# EAGLE design nl (EAGLE 6.3)
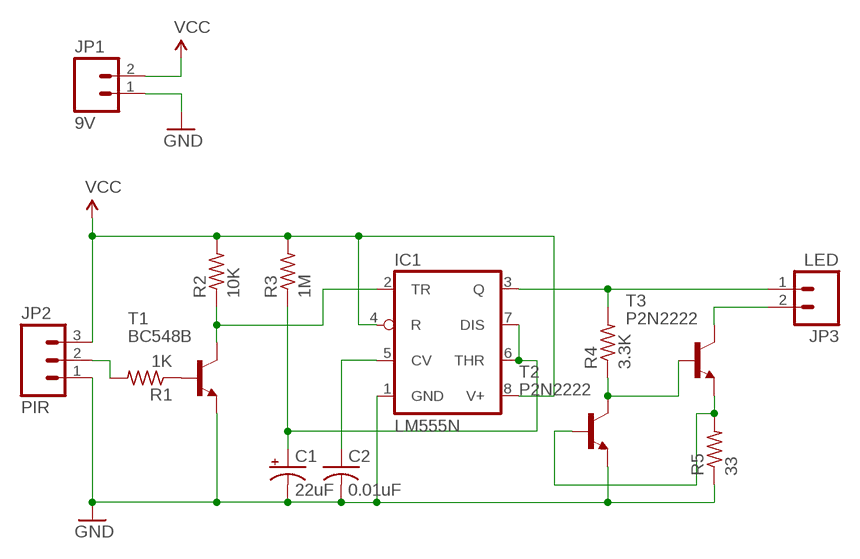
[diagram p0: schematic, sheet 1]

## Parts
C1  22uF  CPOL-USE5-6  [E5-6]
C2  0.01uF  C-US025-024X044  [C025-024X044]
IC1  LM555N  [DIL08-ROUND]
JP1  9V  M02PTH  [1X02]
JP2  PIR  M03PTH  [1X03]
JP3  LED  M02PTH  [1X02]
R1  1K  R-US_0309/12  [0309/12]
R2  10K  R-US_0309/12  [0309/12]
R3  1M  R-US_0309/12  [0309/12]
R4  3.3K  R-US_0309/12  [0309/12]
R5  33  R-US_0309/12  [0309/12]
T1  BC548B  [TO92-EBC]
T2  P2N2222  BC548  [TO92-EBC]
T3  P2N2222  BC548  [TO92-EBC]

## Nets
GND: C1.- C2.2 IC1.1(GND) JP1.1 JP2.1 R5.1 T1.E T2.E
N$1: R1.1 T1.B
N$2: JP2.2 R1.2
N$3: R5.2 T2.B T3.E
N$4: C2.1 IC1.5(CV)
N$5: JP3.2 T3.C
N$6: IC1.3(Q) JP3.1 R4.2
N$7: IC1.2(TR) R2.1 T1.C
N$8: C1.+ IC1.6(THR) IC1.7(DIS) R3.1
N$9: R4.1 T2.C T3.B
VCC: IC1.4(R) IC1.8(V+) JP1.2 JP2.3 R2.2 R3.2

## Library data of the parts
C1 = adafruit:CPOL-US: POLARIZED CAPACITOR, American symbol
C2 = adafruit:C-US: CAPACITOR, American symbol
IC1 = adafruit:*555: TIMER Changed DIP package to have round (not oval) pin pads http://www.ladyada.net/library/pcb/eaglelibrary.html
JP1 JP3 = SparkFun-Connectors:M02: Header 2 Standard 2-pin 0.1" header. Use with straight break away headers (SKU : PRT-00116), right angle break away headers (PRT-00553), swiss pins (PRT-00743), machine pins (PRT-00117), and female headers (PRT-00115). Molex polarized connector foot print use with SKU : PRT-08233 with associated crimp pins and housings.
JP2 = SparkFun-Connectors:M03: Header 3 Standard 3-pin 0.1" header. Use with straight break away headers (SKU : PRT-00116), right angle break away headers (PRT-00553), swiss pins (PRT-00743), machine pins (PRT-00117), and female headers (PRT-00115). Molex polarized connector foot print use with SKU : PRT-08232 with associated crimp pins and housings.
R1-R5 = adafruit:R-US_: RESISTOR, American symbol
T1-T3 = transistor-npn:BC548*: NPN Transistor

## Board
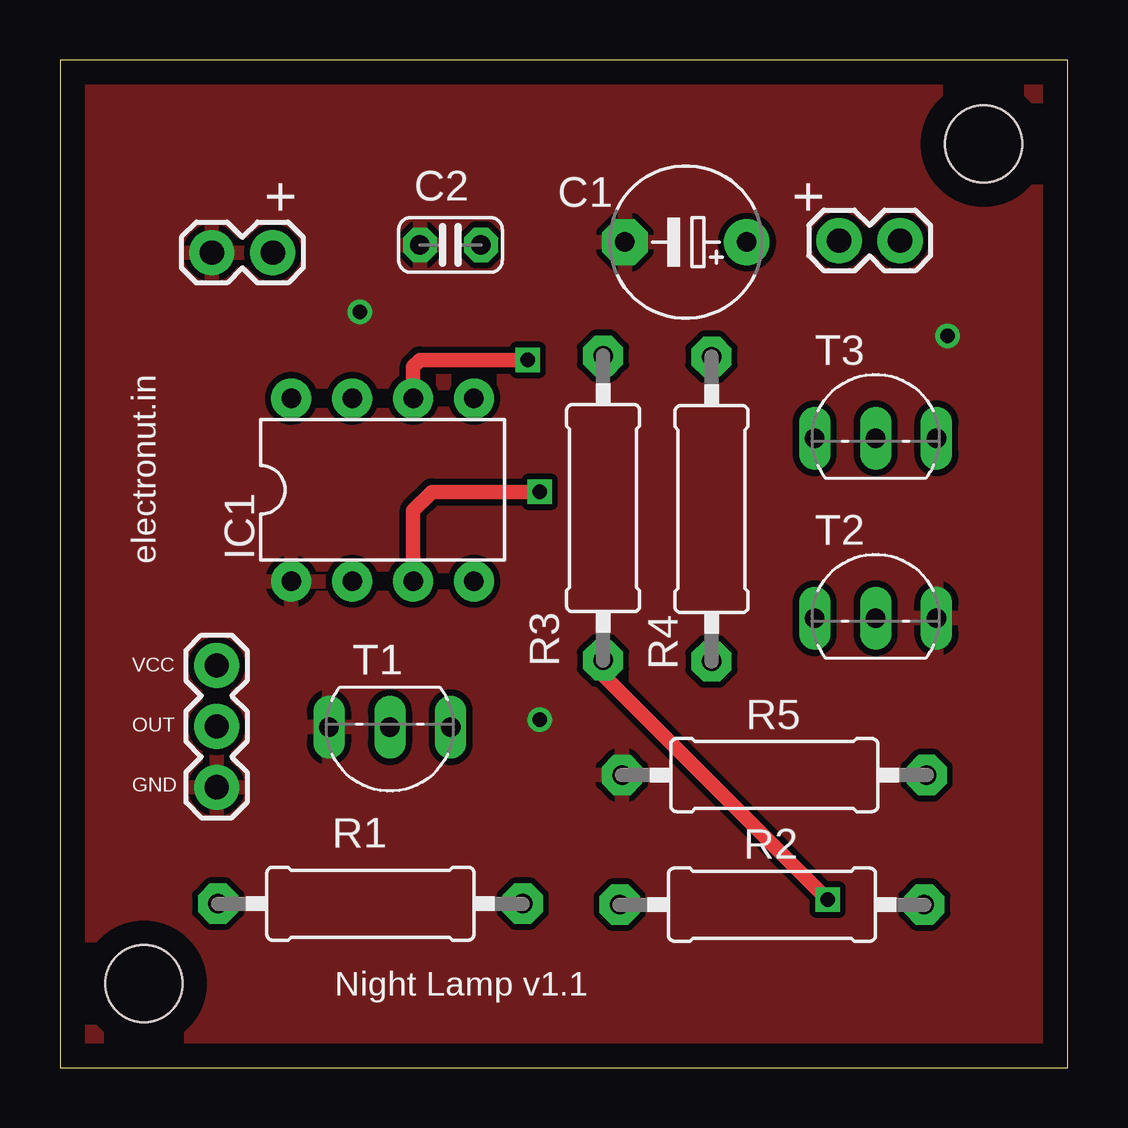
[diagram p1: board, top side]
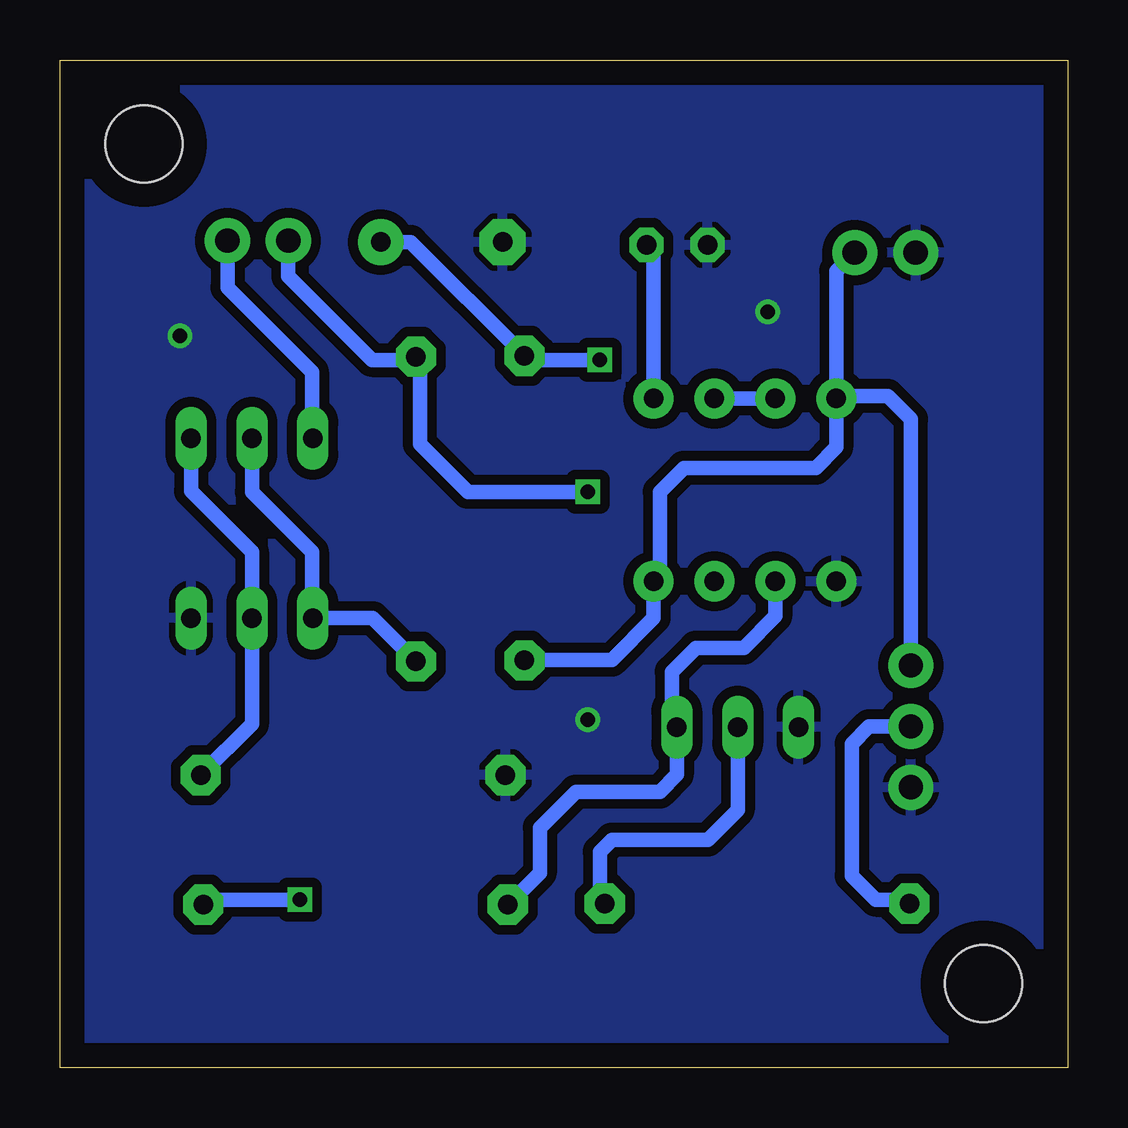
[diagram p2: board, bottom side, seen from below]

Size 42 x 42 mm. Coordinates in mm from the lower left corner, seen from the top.
Outline: 0,0 42,0 42,42 0,42 0,0
Copper layers (1*16): Top 0.035mm / dielectric 1.5mm / Bottom 0.035mm
Design rules "default": minimum track width 10mil, minimum drill 24mil, track to track 8mil, track to pad 8mil, pad to pad 8mil, via to via 8mil, smd to smd 8mil, copper to edge 40mil, drill to drill 8mil, minimum pad ring 10mil, minimum via ring 8mil, stop-mask expansion 4mil, vias tented up to drill 0mil, thermal gap 10mil
Holes 3.2 mm at 3.5,3.5 38.5,38.5

### Footprints (pad centres in the part's own frame; a part is rotated, then mirrored left to right if it is on the bottom)
E5-6 = drill 0.813 pad 1.905: + -2.54,0 | drill 0.813 pad 1.905 octagon: - 2.54,0
C025-024X044 = drill 0.813 pad 1.422 octagon: 1 -1.27,0; 2 1.27,0
DIL08-ROUND = drill 0.813 pad 1.676: 1 -3.81,-3.81; 2 -1.27,-3.81; 3 1.27,-3.81; 4 3.81,-3.81; 5 3.81,3.81; 6 1.27,3.81; 7 -1.27,3.81; 8 -3.81,3.81
1X02 = drill 1.016 pad 1.88: 1 0,0; 2 2.54,0
1X03 = drill 1.016 pad 1.88: 1 0,0; 2 2.54,0; 3 5.08,0
0309/12 = drill 0.813 pad 1.676 octagon: 1 -6.35,0; 2 6.35,0
TO92-EBC = drill 0.813 long: B 0,-1.27; C -2.54,-1.27; E 2.54,-1.27

### Placement (x,y rotation side)
C1  26.09,34.41 180 top
C2  16.28,34.29 180 top
IC1  13.45,24.08 0 top
JP1  6.33,33.97 0 top
JP2  6.53,11.68 90 top
JP3  32.48,34.47 0 top
R1  12.94,6.83 180 top
R2  29.68,6.79 0 top
R3  22.64,23.32 270 top
R4  27.16,23.28 90 top
R5  29.78,12.19 0 top
T1  13.75,12.92 180 top
T2  34,20 0 top
T3  34,27.5 0 top

### Tracks (layer width: path | path; a pad name or v marks a point on that pad's centre or on a via)
GND  (via drill 0.6)
  other vias: 20,14.5 12.5,31.5 37,30.5
  pour Bottom (isolate 0.406): 0.5,42.5 -1,42.5 -1,-0.5 43,-0.5 43,42.5 40.5,42.5
  pour Top (isolate 0.254): 0.5,42.5 -0.5,42.5 -0.5,-0.5 43,-0.5 43,0 43,42.5 37,42.5
N$1
  Bottom 0.61: T1.B 13.75,10.75 15,9.5 19,9.5 19.5,9 19.5,7.04 R1.1
N$2
  Bottom 0.61: JP2.2 8.28,14.22 9,13.5 9,8 8,7 6.76,7 R1.2
N$3
  Bottom 0.61: T3.E 36.54,24.04 34,21.5 T2.B 34,14.32 R5.2
N$4
  Bottom 0.61: C2.1 17.26,34 IC1.5
N$5
  Bottom 0.61: JP3.2 35.02,32.52 31.5,29 31.5,26.27 T3.C
N$6  (via drill 0.6)
  Top 0.61: IC1.3 14.72,23.22 15.5,24 v20,24
  Bottom 0.61: JP3.1 32.48,32.98 29,29.5 27.29,29.5 R4.2 27,29.47 27,26 25,24 v20,24
N$7
  Bottom 0.61: IC1.2 12.18,18.82 13.5,17.5 15.5,17.5 16.5,16.5 16.5,14.4 T1.C 16.29,12.21 17,11.5 20.5,11.5 22,10 22,8.12 R2.1
N$8  (via drill 0.6)
  Top 0.61: IC1.6 14.72,29.22 15,29.5 v19.5,29.5
  Bottom 0.61: IC1.7 IC1.6 | C1.+ 27.38,34.41 R3.1 22.47,29.5 v19.5,29.5
N$9
  Bottom 0.61: T3.B 34,24 31.5,21.5 31.5,18.77 T2.C 28.96,18.73 R4.1
VCC  (via drill 0.6)
  Top 0.61: R3.2 22.64,16.36 v32,7
  Bottom 0.61: JP1.2 9.64,33.2 IC1.8 | IC1.8 9.64,25.86 10.5,25 16,25 17,24 17,20.53 IC1.4 17.26,18.74 19,17 22.61,17 R3.2 | JP2.3 6.53,27.03 7.5,28 9.53,28 IC1.8 | v32,7 35.82,7 R2.2

### Text on the board
tNames: + | + | electronut.in | VCC | OUT | GND | Night Lamp v1.1